# Altium schematic sheet Main.SchDoc
size A3
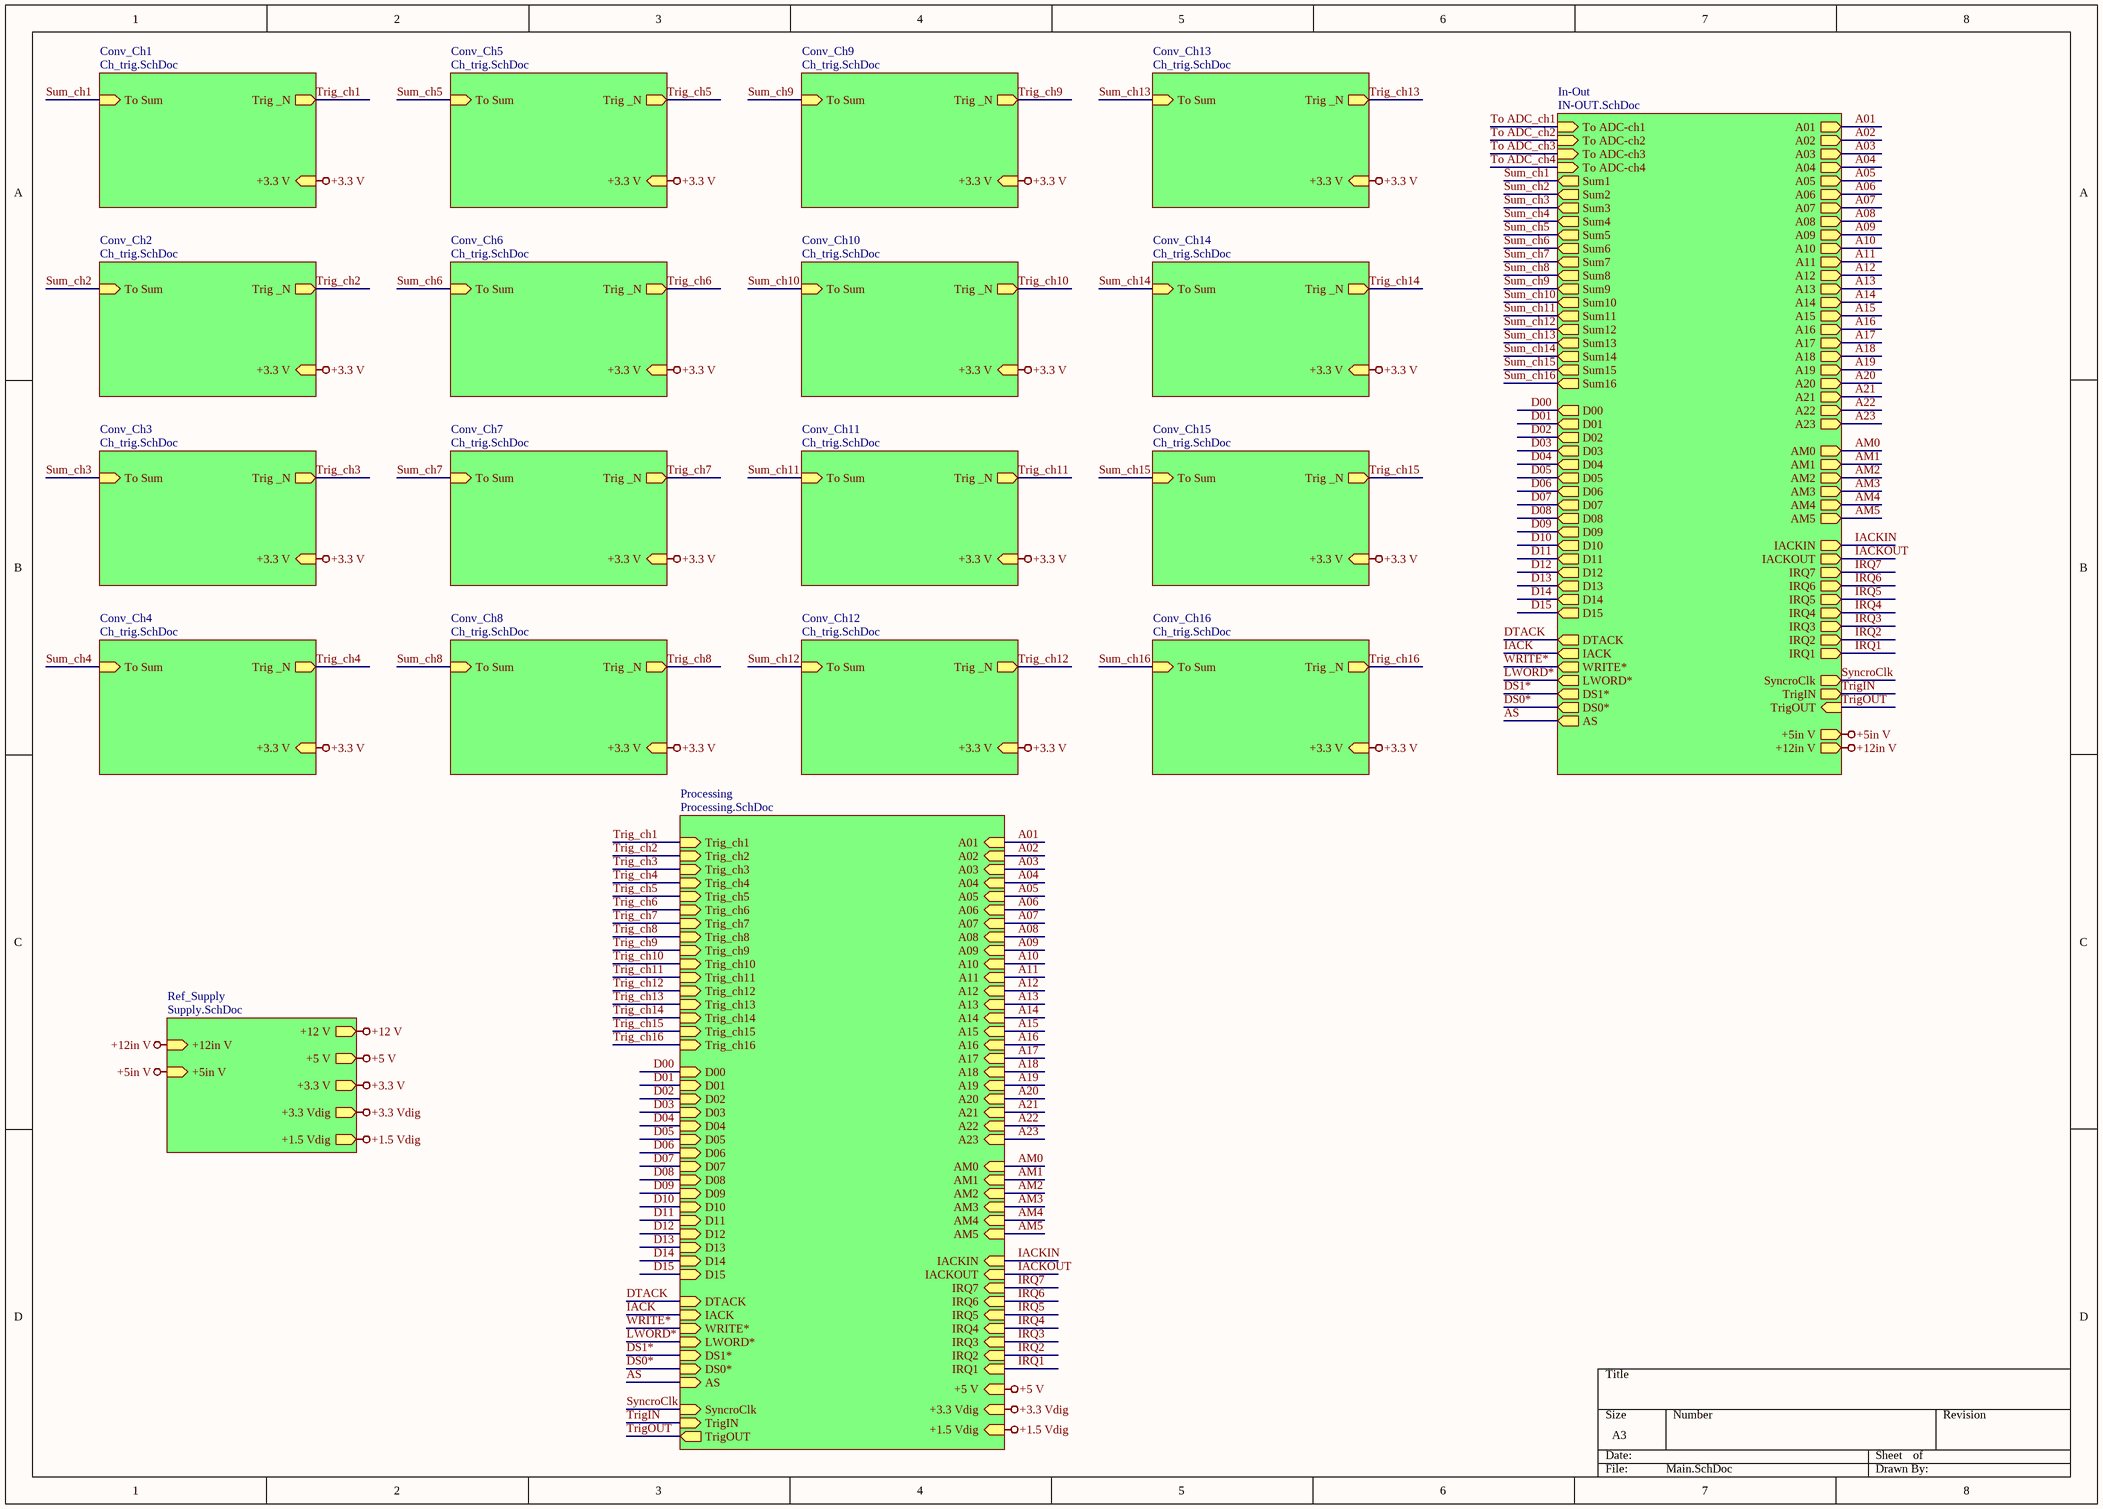
[diagram p0: Main.SchDoc]

## Sub-sheets
Conv_Ch1 = Ch_trig.SchDoc: To Sum (in), Trig _N (out), +3.3 V (in)
Conv_Ch2 = Ch_trig.SchDoc: To Sum (in), Trig _N (out), +3.3 V (in)
Conv_Ch3 = Ch_trig.SchDoc: To Sum (in), Trig _N (out), +3.3 V (in)
Conv_Ch4 = Ch_trig.SchDoc: To Sum (in), Trig _N (out), +3.3 V (in)
Conv_Ch5 = Ch_trig.SchDoc: To Sum (in), Trig _N (out), +3.3 V (in)
Conv_Ch6 = Ch_trig.SchDoc: To Sum (in), Trig _N (out), +3.3 V (in)
Conv_Ch7 = Ch_trig.SchDoc: To Sum (in), Trig _N (out), +3.3 V (in)
Conv_Ch8 = Ch_trig.SchDoc: To Sum (in), Trig _N (out), +3.3 V (in)
Conv_Ch9 = Ch_trig.SchDoc: To Sum (in), Trig _N (out), +3.3 V (in)
Conv_Ch10 = Ch_trig.SchDoc: To Sum (in), Trig _N (out), +3.3 V (in)
Conv_Ch11 = Ch_trig.SchDoc: To Sum (in), Trig _N (out), +3.3 V (in)
Conv_Ch12 = Ch_trig.SchDoc: To Sum (in), Trig _N (out), +3.3 V (in)
Conv_Ch13 = Ch_trig.SchDoc: To Sum (in), Trig _N (out), +3.3 V (in)
Conv_Ch14 = Ch_trig.SchDoc: To Sum (in), Trig _N (out), +3.3 V (in)
Conv_Ch15 = Ch_trig.SchDoc: To Sum (in), Trig _N (out), +3.3 V (in)
Conv_Ch16 = Ch_trig.SchDoc: To Sum (in), Trig _N (out), +3.3 V (in)
In-Out = IN-OUT.SchDoc: To ADC-ch1 (in), To ADC-ch2 (in), To ADC-ch3 (in), To ADC-ch4 (in), Sum4 (out), Sum3 (out), Sum2 (out), Sum1 (out), Sum8 (out), Sum7 (out), Sum6 (out), Sum5 (out), Sum12 (out), Sum11 (out), Sum10 (out), Sum9 (out), Sum16 (out), Sum15 (out), Sum14 (out), Sum13 (out), A01 (out), A02 (out), A03 (out), A04 (out), A05 (out), A06 (out), A07 (out), A08 (out), A09 (out), A10 (out), A11 (out), A12 (out), A13 (out), A14 (out), A15 (out), A16 (out), A18 (out), A19 (out), A20 (out), A21 (out), A22 (out), A23 (out), IRQ7 (out), AM0 (out), AM1 (out), AM2 (out), AM3 (out), AM4 (out), AM5 (out), IRQ6 (out), IACKIN (out), IACKOUT (out), IRQ4 (out), IRQ3 (out), IRQ2 (out), IRQ1 (out), +5in V (out), +12in V (out), IRQ5 (out), A17 (out), D01 (out), D02 (out), D03 (out), D04 (out), D05 (out), D06 (out), D07 (out), D08 (out), D09 (out), D00 (out), D11 (out), D12 (out), D13 (out), D14 (out), D15 (out), D10 (out), DTACK (out), IACK (out), WRITE* (out), LWORD* (out), DS1* (out), DS0* (out), AS (out), TrigOUT (in), SyncroClk (out), TrigIN (out)
Processing = Processing.SchDoc: Trig_ch1 (in), Trig_ch2 (in), Trig_ch3 (in), Trig_ch4 (in), Trig_ch5 (in), Trig_ch6 (in), Trig_ch7 (in), Trig_ch8 (in), Trig_ch9 (in), Trig_ch10 (in), Trig_ch11 (in), Trig_ch12 (in), Trig_ch13 (in), Trig_ch14 (in), Trig_ch15 (in), Trig_ch16 (in), D01 (in), D02 (in), D03 (in), D04 (in), D05 (in), D06 (in), D07 (in), D08 (in), D09 (in), D00 (in), D11 (in), D12 (in), D13 (in), D14 (in), D15 (in), D10 (in), A01 (in), A02 (in), A03 (in), A04 (in), A05 (in), A06 (in), A07 (in), A08 (in), A09 (in), A10 (in), A11 (in), A12 (in), A13 (in), A14 (in), A15 (in), A16 (in), A18 (in), A19 (in), A20 (in), A21 (in), A22 (in), A23 (in), IRQ7 (in), AM0 (in), AM1 (in), AM2 (in), AM3 (in), AM4 (in), AM5 (in), IRQ6 (in), IACKIN (in), IACKOUT (in), DTACK (in), IACK (in), WRITE* (in), LWORD* (in), DS1* (in), DS0* (in), AS (in), IRQ4 (in), IRQ3 (in), IRQ2 (in), IRQ1 (in), +1.5 Vdig (in), +5 V (in), +3.3 Vdig (in), IRQ5 (in), A17 (in), TrigOUT (out), SyncroClk (in), TrigIN (in)
Ref_Supply = Supply.SchDoc: +1.5 Vdig (out), +5 V (out), +3.3 Vdig (out), +12 V (out), +5in V (in), +12in V (in), +3.3 V (out)

## Nets
+1.5 Vdig: sheet Ref_Supply/+1.5 Vdig, sheet Processing/+1.5 Vdig
+3.3 V: sheet Ref_Supply/+3.3 V, sheet Conv_Ch1/+3.3 V, sheet Conv_Ch2/+3.3 V, sheet Conv_Ch3/+3.3 V, sheet Conv_Ch4/+3.3 V, sheet Conv_Ch5/+3.3 V, sheet Conv_Ch6/+3.3 V, sheet Conv_Ch7/+3.3 V, sheet Conv_Ch8/+3.3 V, sheet Conv_Ch9/+3.3 V, sheet Conv_Ch10/+3.3 V, sheet Conv_Ch11/+3.3 V, sheet Conv_Ch12/+3.3 V, sheet Conv_Ch13/+3.3 V, sheet Conv_Ch14/+3.3 V, sheet Conv_Ch15/+3.3 V, sheet Conv_Ch16/+3.3 V
+3.3 Vdig: sheet Ref_Supply/+3.3 Vdig, sheet Processing/+3.3 Vdig
+5 V: sheet Ref_Supply/+5 V, sheet Processing/+5 V
+5in V: sheet Ref_Supply/+5in V, sheet In-Out/+5in V
+12 V: sheet Ref_Supply/+12 V
+12in V: sheet Ref_Supply/+12in V, sheet In-Out/+12in V
A01: sheet In-Out/A01, sheet Processing/A01
A02: sheet In-Out/A02, sheet Processing/A02
A03: sheet In-Out/A03, sheet Processing/A03
A04: sheet In-Out/A04, sheet Processing/A04
A05: sheet In-Out/A05, sheet Processing/A05
A06: sheet In-Out/A06, sheet Processing/A06
A07: sheet In-Out/A07, sheet Processing/A07
A08: sheet In-Out/A08, sheet Processing/A08
A09: sheet In-Out/A09, sheet Processing/A09
A10: sheet In-Out/A10, sheet Processing/A10
A11: sheet In-Out/A11, sheet Processing/A11
A12: sheet In-Out/A12, sheet Processing/A12
A13: sheet In-Out/A13, sheet Processing/A13
A14: sheet In-Out/A14, sheet Processing/A14
A15: sheet In-Out/A15, sheet Processing/A15
A16: sheet In-Out/A16, sheet Processing/A16
A17: sheet In-Out/A17, sheet Processing/A17
A18: sheet In-Out/A18, sheet Processing/A18
A19: sheet In-Out/A19, sheet Processing/A19
A20: sheet In-Out/A20, sheet Processing/A20
A21: sheet In-Out/A21, sheet Processing/A21
A22: sheet In-Out/A22, sheet Processing/A22
A23: sheet In-Out/A23, sheet Processing/A23
AM0: sheet In-Out/AM0, sheet Processing/AM0
AM1: sheet In-Out/AM1, sheet Processing/AM1
AM2: sheet In-Out/AM2, sheet Processing/AM2
AM3: sheet In-Out/AM3, sheet Processing/AM3
AM4: sheet In-Out/AM4, sheet Processing/AM4
AM5: sheet In-Out/AM5, sheet Processing/AM5
AS: sheet In-Out/AS, sheet Processing/AS
D00: sheet In-Out/D00, sheet Processing/D00
D01: sheet In-Out/D01, sheet Processing/D01
D02: sheet In-Out/D02, sheet Processing/D02
D03: sheet In-Out/D03, sheet Processing/D03
D04: sheet In-Out/D04, sheet Processing/D04
D05: sheet In-Out/D05, sheet Processing/D05
D06: sheet In-Out/D06, sheet Processing/D06
D07: sheet In-Out/D07, sheet Processing/D07
D08: sheet In-Out/D08, sheet Processing/D08
D09: sheet In-Out/D09, sheet Processing/D09
D10: sheet In-Out/D10, sheet Processing/D10
D11: sheet In-Out/D11, sheet Processing/D11
D12: sheet In-Out/D12, sheet Processing/D12
D13: sheet In-Out/D13, sheet Processing/D13
D14: sheet In-Out/D14, sheet Processing/D14
D15: sheet In-Out/D15, sheet Processing/D15
DS0*: sheet In-Out/DS0*, sheet Processing/DS0*
DS1*: sheet In-Out/DS1*, sheet Processing/DS1*
DTACK: sheet In-Out/DTACK, sheet Processing/DTACK
IACK: sheet In-Out/IACK, sheet Processing/IACK
IACKIN: sheet In-Out/IACKIN, sheet Processing/IACKIN
IACKOUT: sheet In-Out/IACKOUT, sheet Processing/IACKOUT
IRQ1: sheet In-Out/IRQ1, sheet Processing/IRQ1
IRQ2: sheet In-Out/IRQ2, sheet Processing/IRQ2
IRQ3: sheet In-Out/IRQ3, sheet Processing/IRQ3
IRQ4: sheet In-Out/IRQ4, sheet Processing/IRQ4
IRQ5: sheet In-Out/IRQ5, sheet Processing/IRQ5
IRQ6: sheet In-Out/IRQ6, sheet Processing/IRQ6
IRQ7: sheet In-Out/IRQ7, sheet Processing/IRQ7
LWORD*: sheet In-Out/LWORD*, sheet Processing/LWORD*
Sum_ch1: sheet In-Out/Sum1, sheet Conv_Ch1/To Sum
Sum_ch2: sheet In-Out/Sum2, sheet Conv_Ch2/To Sum
Sum_ch3: sheet In-Out/Sum3, sheet Conv_Ch3/To Sum
Sum_ch4: sheet In-Out/Sum4, sheet Conv_Ch4/To Sum
Sum_ch5: sheet In-Out/Sum5, sheet Conv_Ch5/To Sum
Sum_ch6: sheet In-Out/Sum6, sheet Conv_Ch6/To Sum
Sum_ch7: sheet In-Out/Sum7, sheet Conv_Ch7/To Sum
Sum_ch8: sheet In-Out/Sum8, sheet Conv_Ch8/To Sum
Sum_ch9: sheet In-Out/Sum9, sheet Conv_Ch9/To Sum
Sum_ch10: sheet In-Out/Sum10, sheet Conv_Ch10/To Sum
Sum_ch11: sheet In-Out/Sum11, sheet Conv_Ch11/To Sum
Sum_ch12: sheet In-Out/Sum12, sheet Conv_Ch12/To Sum
Sum_ch13: sheet In-Out/Sum13, sheet Conv_Ch13/To Sum
Sum_ch14: sheet In-Out/Sum14, sheet Conv_Ch14/To Sum
Sum_ch15: sheet In-Out/Sum15, sheet Conv_Ch15/To Sum
Sum_ch16: sheet In-Out/Sum16, sheet Conv_Ch16/To Sum
SyncroClk: sheet In-Out/SyncroClk, sheet Processing/SyncroClk
To ADC_ch1: sheet In-Out/To ADC-ch1
To ADC_ch2: sheet In-Out/To ADC-ch2
To ADC_ch3: sheet In-Out/To ADC-ch3
To ADC_ch4: sheet In-Out/To ADC-ch4
Trig_ch1: sheet Conv_Ch1/Trig _N, sheet Processing/Trig_ch1
Trig_ch2: sheet Conv_Ch2/Trig _N, sheet Processing/Trig_ch2
Trig_ch3: sheet Conv_Ch3/Trig _N, sheet Processing/Trig_ch3
Trig_ch4: sheet Conv_Ch4/Trig _N, sheet Processing/Trig_ch4
Trig_ch5: sheet Processing/Trig_ch5, sheet Conv_Ch5/Trig _N
Trig_ch6: sheet Processing/Trig_ch6, sheet Conv_Ch6/Trig _N
Trig_ch7: sheet Processing/Trig_ch7, sheet Conv_Ch7/Trig _N
Trig_ch8: sheet Processing/Trig_ch8, sheet Conv_Ch8/Trig _N
Trig_ch9: sheet Processing/Trig_ch9, sheet Conv_Ch9/Trig _N
Trig_ch10: sheet Processing/Trig_ch10, sheet Conv_Ch10/Trig _N
Trig_ch11: sheet Processing/Trig_ch11, sheet Conv_Ch11/Trig _N
Trig_ch12: sheet Processing/Trig_ch12, sheet Conv_Ch12/Trig _N
Trig_ch13: sheet Processing/Trig_ch13, sheet Conv_Ch13/Trig _N
Trig_ch14: sheet Processing/Trig_ch14, sheet Conv_Ch14/Trig _N
Trig_ch15: sheet Processing/Trig_ch15, sheet Conv_Ch15/Trig _N
Trig_ch16: sheet Processing/Trig_ch16, sheet Conv_Ch16/Trig _N
TrigIN: sheet In-Out/TrigIN, sheet Processing/TrigIN
TrigOUT: sheet In-Out/TrigOUT, sheet Processing/TrigOUT
WRITE*: sheet In-Out/WRITE*, sheet Processing/WRITE*